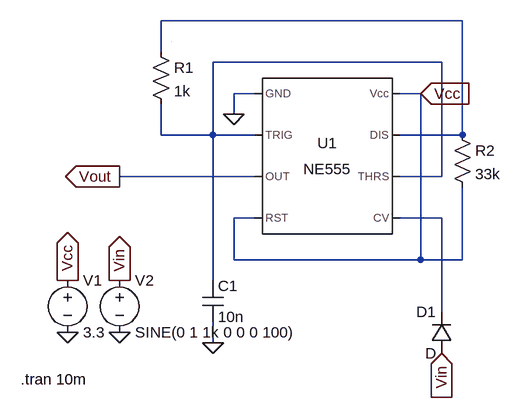
[diagram p0: schematic VCO_555.asc]
VCO_555.asc, the LTspice schematic file:
Version 4
SHEET 1 880 680
WIRE 448 -32 -16 -32
WIRE -16 16 -16 -32
WIRE 416 32 64 32
WIRE 128 80 96 80
WIRE 384 80 352 80
WIRE 96 112 96 80
WIRE -16 144 -16 96
WIRE 64 144 64 32
WIRE 64 144 -16 144
WIRE 128 144 64 144
WIRE 448 144 448 -32
WIRE 448 144 352 144
WIRE 128 208 -80 208
WIRE 416 208 416 32
WIRE 416 208 352 208
WIRE 128 272 96 272
WIRE 416 272 352 272
WIRE 96 336 96 272
WIRE 384 336 384 80
WIRE 384 336 96 336
WIRE 448 336 448 224
WIRE 448 336 384 336
WIRE 64 368 64 144
WIRE 416 416 416 272
WIRE 64 464 64 432
WIRE 0 0 0 0
FLAG -160 448 0
FLAG -160 368 Vcc
IOPIN -160 368 Out
FLAG 96 112 0
FLAG 64 464 0
FLAG 384 80 Vcc
IOPIN 384 80 In
FLAG -80 208 Vout
IOPIN -80 208 Out
FLAG -80 448 0
FLAG -80 368 Vin
IOPIN -80 368 Out
FLAG 416 480 Vin
IOPIN 416 480 In
SYMBOL Misc\\NE555 240 176 R0
SYMATTR InstName U1
SYMBOL voltage -160 352 R0
WINDOW 123 0 0 Left 0
WINDOW 39 0 0 Left 0
SYMATTR InstName V1
SYMATTR Value 3.3
SYMBOL res -32 0 R0
SYMATTR InstName R1
SYMATTR Value 1k
SYMBOL cap 48 368 R0
SYMATTR InstName C1
SYMATTR Value 10n
SYMBOL res 432 128 R0
SYMATTR InstName R2
SYMATTR Value 33k
SYMBOL voltage -80 352 R0
WINDOW 123 0 0 Left 0
WINDOW 39 0 0 Left 0
SYMATTR InstName V2
SYMATTR Value SINE(0 1 1k 0 0 0 100)
SYMBOL diode 432 480 R180
WINDOW 0 24 64 Left 2
WINDOW 3 24 0 Left 2
SYMATTR InstName D1
TEXT -232 520 Left 2 !.tran 10m

The netlist it stands for:
* VCO_555.asc
XU1 0 N002 Vout Vcc N003 N002 N001 Vcc NE555  ; pins GND TRIG OUT RST CV THRS DIS Vcc
V1 Vcc 0 3.3
R1 N001 N002 1k
C1 N002 0 10n
R2 N001 Vcc 33k
V2 Vin 0 SINE(0 1 1k 0 0 0 100)
D1 Vin N003 D
.model D D
.lib standard.dio
.tran 10m
.lib NE555.sub
.backanno
.end